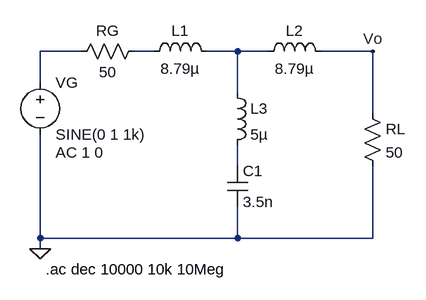
[diagram p0: schematic ej6.asc]
ej6.asc, the LTspice schematic file:
Version 4
SHEET 1 904 888
WIRE 96 96 32 96
WIRE 208 96 176 96
WIRE 336 96 288 96
WIRE 384 96 336 96
WIRE 544 96 464 96
WIRE 32 144 32 96
WIRE 336 160 336 96
WIRE 544 192 544 96
WIRE 336 272 336 240
WIRE 32 384 32 224
WIRE 336 384 336 336
WIRE 336 384 32 384
WIRE 544 384 544 272
WIRE 544 384 336 384
WIRE 32 400 32 384
FLAG 32 400 0
FLAG 544 96 Vo
SYMBOL voltage 32 128 R0
WINDOW 123 24 124 Left 2
WINDOW 39 0 0 Left 0
SYMATTR InstName VG
SYMATTR Value SINE(0 1 1k)
SYMATTR Value2 AC 1 0
SYMBOL ind 192 112 R270
WINDOW 0 32 56 VTop 2
WINDOW 3 5 56 VBottom 2
SYMATTR InstName L1
SYMATTR Value 8.79µ
SYMBOL ind 368 112 R270
WINDOW 0 32 56 VTop 2
WINDOW 3 5 56 VBottom 2
SYMATTR InstName L2
SYMATTR Value 8.79µ
SYMBOL ind 320 144 R0
SYMATTR InstName L3
SYMATTR Value 5µ
SYMBOL cap 320 272 R0
SYMATTR InstName C1
SYMATTR Value 3.5n
SYMBOL res 192 80 R90
WINDOW 0 0 56 VBottom 2
WINDOW 3 32 56 VTop 2
SYMATTR InstName RG
SYMATTR Value 50
SYMBOL res 528 176 R0
SYMATTR InstName RL
SYMATTR Value 50
TEXT 40 432 Left 2 !.ac dec 10000 10k 10Meg

The netlist it stands for:
* ej6.asc
VG N001 0 SINE(0 1 1k) AC 1 0
L1 N002 N003 8.79µ
L2 N003 Vo 8.79µ
L3 N003 N004 5µ
C1 N004 0 3.5n
RG N002 N001 50
RL Vo 0 50
.ac dec 10000 10k 10Meg
.backanno
.end